# Altium project Projet_Carte_Bras_TurtleBot.PrjPcb
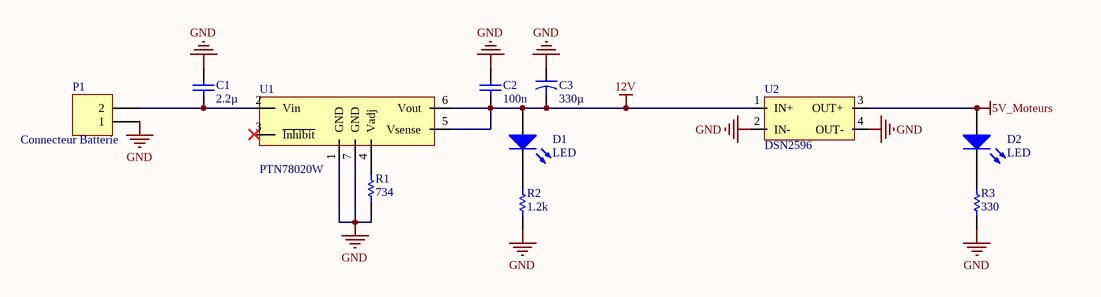
[diagram p0: Alimentations.SchDoc]
4 sheets, 85 parts. Net scope: flat (ports and power ports of the same name join across sheets).
Sheets:
  Alimentations.SchDoc
  Microcontroleur.SchDoc
  Connecteurs.SchDoc
  Controle Moteurs.SchDoc

## Sheet Alimentations.SchDoc
size A4

### Parts
C1  value 2.2µ  [RAD-0.3]  (hidden comment: Cap)
C2  value 100n  [RAD-0.3]  (hidden comment: Cap)
C3  value 330µ  [CAPR5-4X5]  (hidden comment: Cap2)
D1  LED  [C0805]
D2  LED  [C0805]
P1  Connecteur Batterie  [HDR1X2]
R1  value 734  [AXIAL-0.3]  (hidden comment: Res1)
R2  value 1.2k  [AXIAL-0.3]  (hidden comment: Res1)
R3  value 330  [AXIAL-0.3]  (hidden comment: Res1)
U1  PTN78020W
U2  DSN2596

### Nets
5V_Moteurs: D2.1(A) U2.3(OUT+)
12V: C2.1 C3.2 D1.1(A) U1.5(Vsense) U1.6(Vout) U2.1(IN+)
GND: C1.2 C2.2 C3.1 P1.1 R1.1 R2.2 R3.2 U1.1(GND) U1.7(GND) U2.2(IN-) U2.4(OUT-)
NetC1_1: C1.1 P1.2 U1.2(Vin)
NetD1_2: D1.2(K) R2.1
NetD2_2: D2.2(K) R3.1
NetR1_2: R1.2 U1.4(Vadj)

Not connected (* = marked no-connect by the designer): U1 3(~{Inhibit})*

### Library data of the parts
C1 = Cap: 2.2µ; Published: 8-Jun-2000; LatestRevisionDate: 17-Jul-2002; LatestRevisionNote: Re-released for DXP Platform.; PackageReference: RAD-0.3; Publisher: Altium Limited
C2 = Cap: 100n; Published: 8-Jun-2000; LatestRevisionDate: 17-Jul-2002; LatestRevisionNote: Re-released for DXP Platform.; PackageReference: RAD-0.3; Publisher: Altium Limited
C3 = Cap2: 330µ; Published: 23-Sep-2002; PackageReference: CAPR5-4X5; Publisher: Altium Limited
D1 = LED1: LED Bleu; Published: 8-Jun-2000; LatestRevisionDate: 08-Jul-2005; LatestRevisionNote: Mech Layer 1 removed.; PackageReference: LED-1; Publisher: Altium Limited
D2 = LED1: LED Verte; Published: 8-Jun-2000; LatestRevisionDate: 08-Jul-2005; LatestRevisionNote: Mech Layer 1 removed.; PackageReference: LED-1; Publisher: Altium Limited
P1 = Header 2: Header, 2-Pin; LatestRevisionDate: 17-Jul-2002; LatestRevisionNote: Re-released for DXP Platform.; Publisher: Altium Limited
R1 = Res1: 734R 1%; Published: 8-Jun-2000; LatestRevisionDate: 17-Jul-2002; LatestRevisionNote: Re-released for DXP Platform.; PackageReference: AXIAL-0.3; Publisher: Altium Limited
R2 = Res1: 1.2k; Published: 8-Jun-2000; LatestRevisionDate: 17-Jul-2002; LatestRevisionNote: Re-released for DXP Platform.; PackageReference: AXIAL-0.3; Publisher: Altium Limited
R3 = Res1: 330R; Published: 8-Jun-2000; LatestRevisionDate: 17-Jul-2002; LatestRevisionNote: Re-released for DXP Platform.; PackageReference: AXIAL-0.3; Publisher: Altium Limited
U1 = PTN78020W: Alim à découpage 6A
U2 = DSN2596: Module Buck 24V 12V 5V - 3A

## Sheet Microcontroleur.SchDoc
size A4
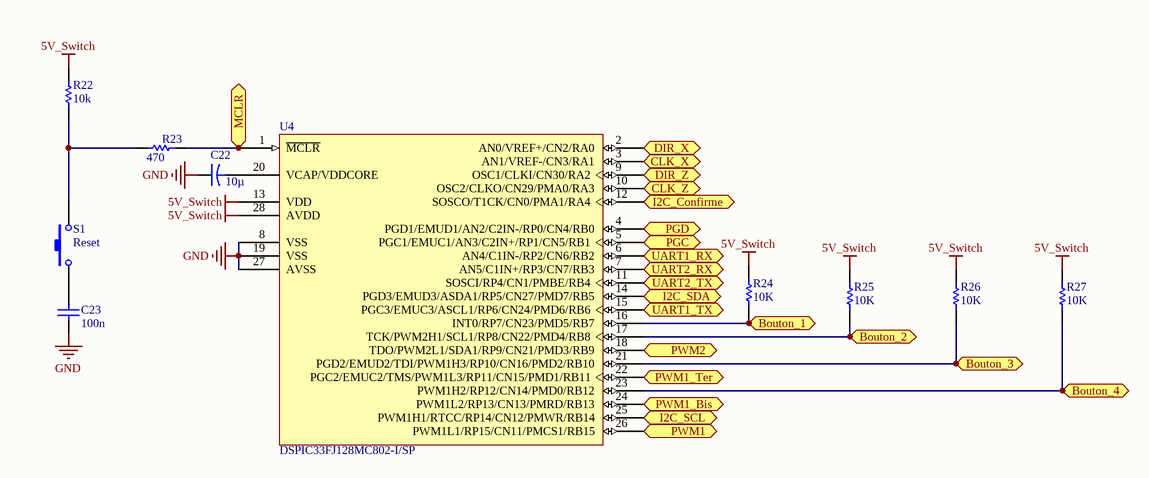
[diagram p1: Microcontroleur.SchDoc]

### Parts
C22  value 10µ  [CAPR5-4X5]  (hidden comment: Cap2)
C23  value 100n  [RAD-0.3]  (hidden comment: Cap)
R22  value 10k  [AXIAL-0.3]  (hidden comment: Res1)
R23  value 470  [AXIAL-0.3]  (hidden comment: Res1)
R24  value 10K  [AXIAL-0.3]  (hidden comment: Res1)
R25  value 10K  [AXIAL-0.3]  (hidden comment: Res1)
R26  value 10K  [AXIAL-0.3]  (hidden comment: Res1)
R27  value 10K  [AXIAL-0.3]  (hidden comment: Res1)
S1  Reset  [SPST-2]
U4  DSPIC33FJ128MC802-I/SP  [SPDIP300-SP28]

### Ports
Bouton_1, Bouton_2, Bouton_3, Bouton_4, CLK_X, CLK_Z, DIR_X, DIR_Z, I2C_Confirme, I2C_SCL, I2C_SDA, MCLR, PGC, PGD, PWM1, PWM1_Bis, PWM1_Ter, PWM2, UART1_RX, UART1_TX, UART2_RX, UART2_TX

### Nets
5V_Switch: R22.2 R24.1 R25.1 R26.1 R27.1 U4.13(VDD) U4.28(AVDD)
GND: C22.1 C23.2 U4.8(VSS) U4.19(VSS) U4.27(AVSS)
NetC22_2: C22.2 U4.20(VCAP/VDDCORE)
NetC23_1: C23.1 S1.1
NetJ1_18: U4.9(OSC1/CLKI/CN30/RA2) ; port DIR_Z
NetJ1_19: U4.10(OSC2/CLKO/CN29/PMA0/RA3) ; port CLK_Z
NetJ2_18: U4.2(AN0/VREF+/CN2/RA0) ; port DIR_X
NetJ2_19: U4.3(AN1/VREF-/CN3/RA1) ; port CLK_X
NetP2_1: U4.18(TDO/PWM2L1/SDA1/RP9/CN21/PMD3/RB9) ; port PWM2
NetP3_2: R24.2 U4.16(INT0/RP7/CN23/PMD5/RB7) ; port Bouton_1
NetP5_2: U4.7(AN5/C1IN+/RP3/CN7/RB3) ; port UART2_RX
NetP5_3: U4.11(SOSCI/RP4/CN1/PMBE/RB4) ; port UART2_TX
NetP6_2: R25.2 U4.17(TCK/PWM2H1/SCL1/RP8/CN22/PMD4/RB8) ; port Bouton_2
NetP8_1: U4.22(PGC2/EMUC2/TMS/PWM1L3/RP11/CN15/PMD1/RB11) ; port PWM1_Ter
NetP9_2: R26.2 U4.21(PGD2/EMUD2/TDI/PWM1H3/RP10/CN16/PMD2/RB10) ; port Bouton_3
NetP11_2: R27.2 U4.23(PWM1H2/RP12/CN14/PMD0/RB12) ; port Bouton_4
NetP13_1: U4.24(PWM1L2/RP13/CN13/PMRD/RB13) ; port PWM1_Bis
NetP14_1: R23.2 U4.1(~{MCLR}) ; port MCLR
NetP14_4: U4.4(PGD1/EMUD1/AN2/C2IN-/RP0/CN4/RB0) ; port PGD
NetP14_5: U4.5(PGC1/EMUC1/AN3/C2IN+/RP1/CN5/RB1) ; port PGC
NetP16_1: U4.26(PWM1L1/RP15/CN11/PMCS1/RB15) ; port PWM1
NetQ1_1: U4.15(PGC3/EMUC3/ASCL1/RP6/CN24/PMD6/RB6) ; port UART1_TX
NetQ2_1: U4.6(AN4/C1IN-/RP2/CN6/RB2) ; port UART1_RX
NetR22_1: R22.1 R23.1 S1.2
NetU3_11: U4.25(PWM1H1/RTCC/RP14/CN12/PMWR/RB14) ; port I2C_SCL
NetU3_12: U4.12(SOSCO/T1CK/CN0/PMA1/RA4) ; port I2C_Confirme
NetU3_14: U4.14(PGD3/EMUD3/ASDA1/RP5/CN27/PMD7/RB5) ; port I2C_SDA

### Library data of the parts
C22 = Cap2: 10µ; Published: 23-Sep-2002; PackageReference: CAPR5-4X5; Publisher: Altium Limited
C23 = Cap: 100n; Published: 8-Jun-2000; LatestRevisionDate: 17-Jul-2002; LatestRevisionNote: Re-released for DXP Platform.; PackageReference: RAD-0.3; Publisher: Altium Limited
R22 R24-R27 = Res1: 10k; Published: 8-Jun-2000; LatestRevisionDate: 17-Jul-2002; LatestRevisionNote: Re-released for DXP Platform.; PackageReference: AXIAL-0.3; Publisher: Altium Limited
R23 = Res1: 470R; Published: 8-Jun-2000; LatestRevisionDate: 17-Jul-2002; LatestRevisionNote: Re-released for DXP Platform.; PackageReference: AXIAL-0.3; Publisher: Altium Limited
S1 = SW-PB: Bouton Reset; Published: 24-Mar-1999; LatestRevisionDate: 17-Jul-2002; LatestRevisionNote: Re-released for DXP Platform.; PackageReference: SPST-2; Publisher: Altium Limited; PackageDescription: Switch; 2 Leads
U4 = DSPIC33FJ128MC802-I/SP: High-Performance 16-bit Digital Signal Controller, 128 KB Flash, 16 KB RAM, 28-Pin SPDIP, Industrial Temperature; FirstPublished: 29-Jan-2009; LatestRevisionDate: 02-Dec-2009; LatestRevisionNote: Updated to datasheet revision D, Nov-2009; DatasheetVersion: revD, Nov-2009; PackageVersion: revBB, Aug-2009; PackageReference: SPDIP300-SP28; Publisher: Altium Limited; PackageDescription: 28-Lead Skinny Plastic Dual In-Line (SP) - 300 mil Body [SPDIP]; Supplier 1: Digi-Key; Supplier Part Number 1: DSPIC33FJ128MC802-I/SP-ND; Supplier 2: Farnell; Supplier Part Number 2: 1576808; Supplier 3: Newark; Supplier Part Number 3: 39M8141; ComponentLink1Description: Datasheet; ComponentLink1URL: http://ww1.microchip.com/downloads/en/DeviceDoc/70291D.pdf; ComponentLink2Description: Packaging Specification; ComponentLink2URL: http://www.microchip.com/stellent/groups/techpub_sg/documents/packagingspec/en012702.pdf; ComponentLink3Description: Microchip.com Home; ComponentLink3URL: http://www.microchip.com/

## Sheet Connecteurs.SchDoc
size A4
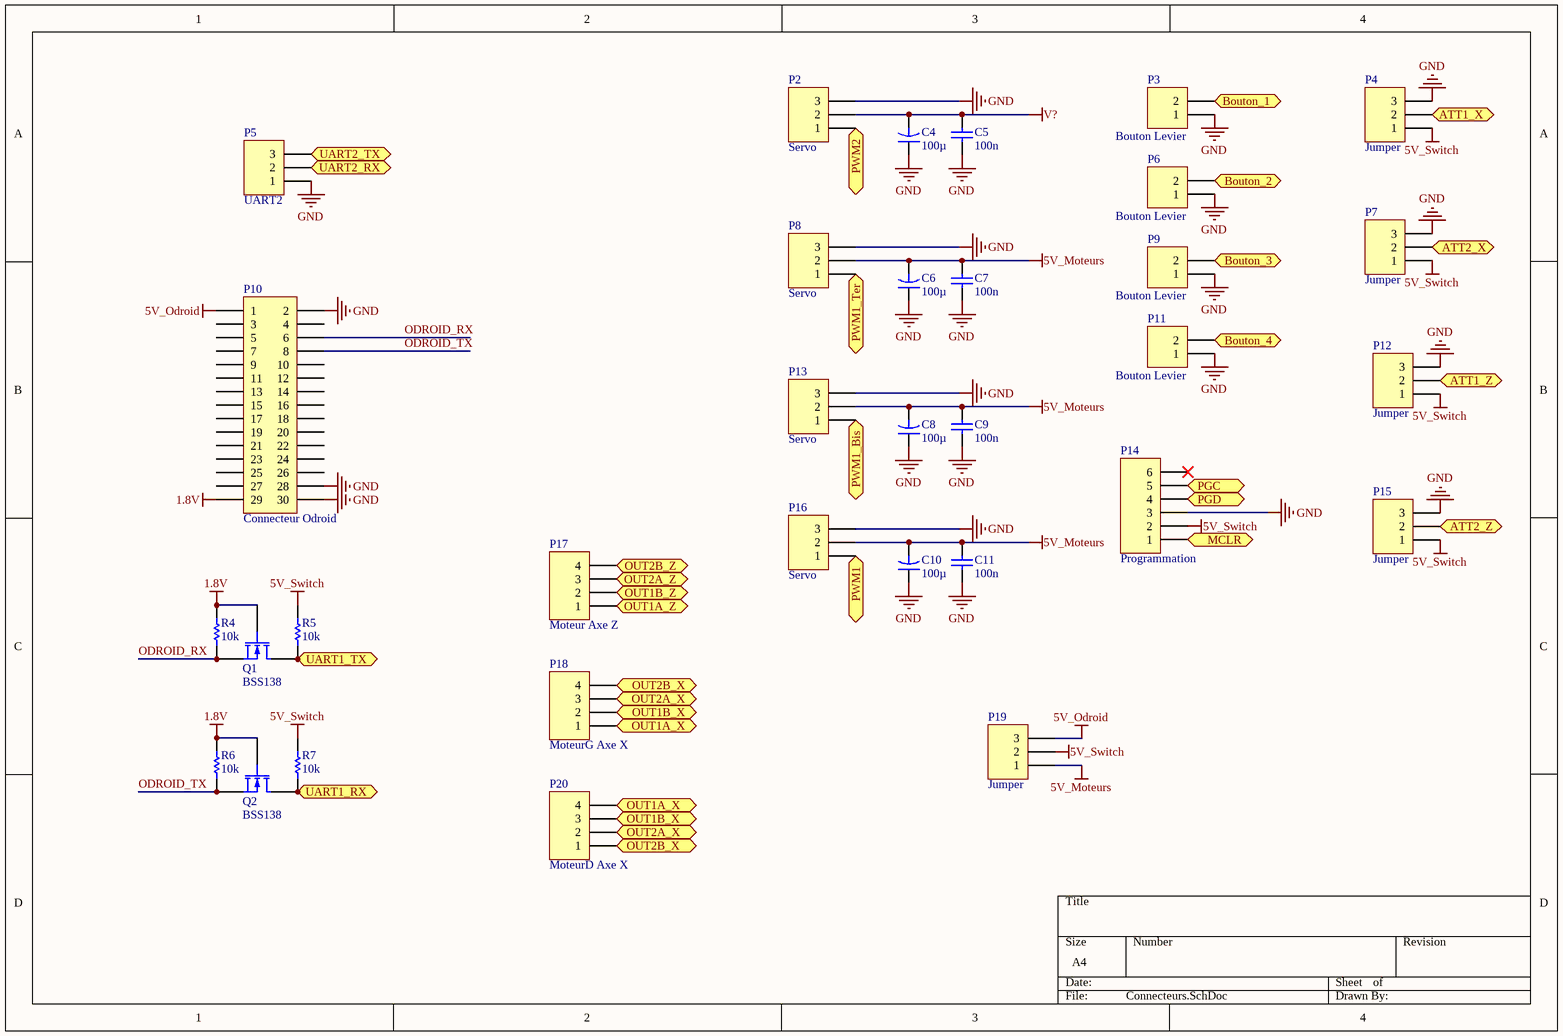
[diagram p2: Connecteurs.SchDoc]

### Parts
C4  value 100µ  [CAPR5-4X5]  (hidden comment: Cap2)
C5  value 100n  [RAD-0.3]  (hidden comment: Cap)
C6  value 100µ  [CAPR5-4X5]  (hidden comment: Cap2)
C7  value 100n  [RAD-0.3]  (hidden comment: Cap)
C8  value 100µ  [CAPR5-4X5]  (hidden comment: Cap2)
C9  value 100n  [RAD-0.3]  (hidden comment: Cap)
C10  value 100µ  [CAPR5-4X5]  (hidden comment: Cap2)
C11  value 100n  [RAD-0.3]  (hidden comment: Cap)
P2  Servo  [HDR1X3]
P3  Bouton Levier  [HDR1X2]
P4  Jumper  [HDR1X3]
P5  UART2  [HDR1X3]
P6  Bouton Levier  [HDR1X2]
P7  Jumper  [HDR1X3]
P8  Servo  [HDR1X3]
P9  Bouton Levier  [HDR1X2]
P10  Connecteur Odroid  [HDR2X15]
P11  Bouton Levier  [HDR1X2]
P12  Jumper  [HDR1X3]
P13  Servo  [HDR1X3]
P14  Programmation  [HDR1X6]
P15  Jumper  [HDR1X3]
P16  Servo  [HDR1X3]
P17  Moteur Axe Z  [HDR1X4]
P18  MoteurG Axe X  [HDR1X4]
P19  Jumper  [HDR1X3]
P20  MoteurD Axe X  [HDR1X4]
Q1  BSS138  [E3]
Q2  BSS138  [E3]
R4  value 10k  [AXIAL-0.3]  (hidden comment: Res1)
R5  value 10k  [AXIAL-0.3]  (hidden comment: Res1)
R6  value 10k  [AXIAL-0.3]  (hidden comment: Res1)
R7  value 10k  [AXIAL-0.3]  (hidden comment: Res1)

### Ports
ATT1_X, ATT1_Z, ATT2_X, ATT2_Z, Bouton_1, Bouton_2, Bouton_3, Bouton_4, MCLR, OUT1A_X, OUT1A_Z, OUT1B_X, OUT1B_Z, OUT2A_X, OUT2A_Z, OUT2B_X, OUT2B_Z, PGC, PGD, PWM1, PWM1_Bis, PWM1_Ter, PWM2, UART1_RX, UART1_TX, UART2_RX, UART2_TX

### Nets
1.8V: P10.29 Q1.2(G) Q2.2(G) R4.1 R6.1
5V_Moteurs: C6.2 C7.1 C8.2 C9.1 C10.2 C11.1 P8.2 P13.2 P16.2 P19.1
5V_Odroid: P10.1 P19.3
5V_Switch: P4.1 P7.1 P12.1 P14.2 P15.1 P19.2 R5.1 R7.1
GND: C4.1 C5.2 C6.1 C7.2 C8.1 C9.2 C10.1 C11.2 P2.3 P3.1 P4.3 P5.1 P6.1 P7.3 P8.3 P9.1 P10.2 P10.28 P10.30 P11.1 P12.3 P13.3 P14.3 P15.3 P16.3
V?: C4.2 C5.1 P2.2
ODROID_RX: P10.6 Q1.3(S) R4.2
ODROID_TX: P10.8 Q2.3(S) R6.2
NetJ1_3: P17.1 ; port OUT1A_Z
NetJ1_7: P17.2 ; port OUT1B_Z
NetJ1_8: P17.3 ; port OUT2A_Z
NetJ1_12: P17.4 ; port OUT2B_Z
NetJ1_24: P12.2 ; port ATT1_Z
NetJ1_25: P15.2 ; port ATT2_Z
NetJ2_3: P18.1 P20.4 ; port OUT1A_X
NetJ2_7: P18.2 P20.3 ; port OUT1B_X
NetJ2_8: P18.3 P20.2 ; port OUT2A_X
NetJ2_12: P18.4 P20.1 ; port OUT2B_X
NetJ2_24: P4.2 ; port ATT1_X
NetJ2_25: P7.2 ; port ATT2_X
NetP2_1: P2.1 ; port PWM2
NetP3_2: P3.2 ; port Bouton_1
NetP5_2: P5.2 ; port UART2_RX
NetP5_3: P5.3 ; port UART2_TX
NetP6_2: P6.2 ; port Bouton_2
NetP8_1: P8.1 ; port PWM1_Ter
NetP9_2: P9.2 ; port Bouton_3
NetP11_2: P11.2 ; port Bouton_4
NetP13_1: P13.1 ; port PWM1_Bis
NetP14_1: P14.1 ; port MCLR
NetP14_4: P14.4 ; port PGD
NetP14_5: P14.5 ; port PGC
NetP16_1: P16.1 ; port PWM1
NetQ1_1: Q1.1(D) R5.2 ; port UART1_TX
NetQ2_1: Q2.1(D) R7.2 ; port UART1_RX

Not connected (* = marked no-connect by the designer): P10 3 4 5 7 9 10 11 12 13 14 15 16 17 18 19 20 21 22 23 24 25 26 27; P14 6*

### Library data of the parts
C4 C6 C8 C10 = Cap2: 100µ; Published: 23-Sep-2002; PackageReference: CAPR5-4X5; Publisher: Altium Limited
C5 C7 C9 C11 = Cap: 100n; Published: 8-Jun-2000; LatestRevisionDate: 17-Jul-2002; LatestRevisionNote: Re-released for DXP Platform.; PackageReference: RAD-0.3; Publisher: Altium Limited
P2 P4 P5 P7 P8 P12 P13 P15 P16 P19 = Header 3: Header, 3-Pin; LatestRevisionDate: 17-Jul-2002; LatestRevisionNote: Re-released for DXP Platform.; Publisher: Altium Limited
P3 P6 P9 P11 = Header 2: Header, 2-Pin; LatestRevisionDate: 17-Jul-2002; LatestRevisionNote: Re-released for DXP Platform.; Publisher: Altium Limited
P10 = Header 15X2: Header, 15-Pin, Dual row; LatestRevisionDate: 17-Jul-2002; LatestRevisionNote: Re-released for DXP Platform.; Publisher: Altium Limited
P14 = Header 6: Header, 6-Pin; LatestRevisionDate: 17-Jul-2002; LatestRevisionNote: Re-released for DXP Platform.; Publisher: Altium Limited
P17 P18 P20 = Header 4: Header, 4-Pin; LatestRevisionDate: 17-Jul-2002; LatestRevisionNote: Re-released for DXP Platform.; Publisher: Altium Limited
Q1 Q2 = MOSFET-N: N-Channel MOSFET; Published: 8-Jun-2000; LatestRevisionDate: 17-Jul-2002; LatestRevisionNote: Re-released for DXP Platform.; PackageVersion: 1995/1996; PackageReference: E3; Publisher: Altium Limited; PackageDescription: TO, Flat Index; 3 In-Line, Axial Leads; Body Dia. 4.6mm; Lead Dia. 0.5 mm (max)
R4-R7 = Res1: 10k; Published: 8-Jun-2000; LatestRevisionDate: 17-Jul-2002; LatestRevisionNote: Re-released for DXP Platform.; PackageReference: AXIAL-0.3; Publisher: Altium Limited

## Sheet Controle Moteurs.SchDoc
size A4
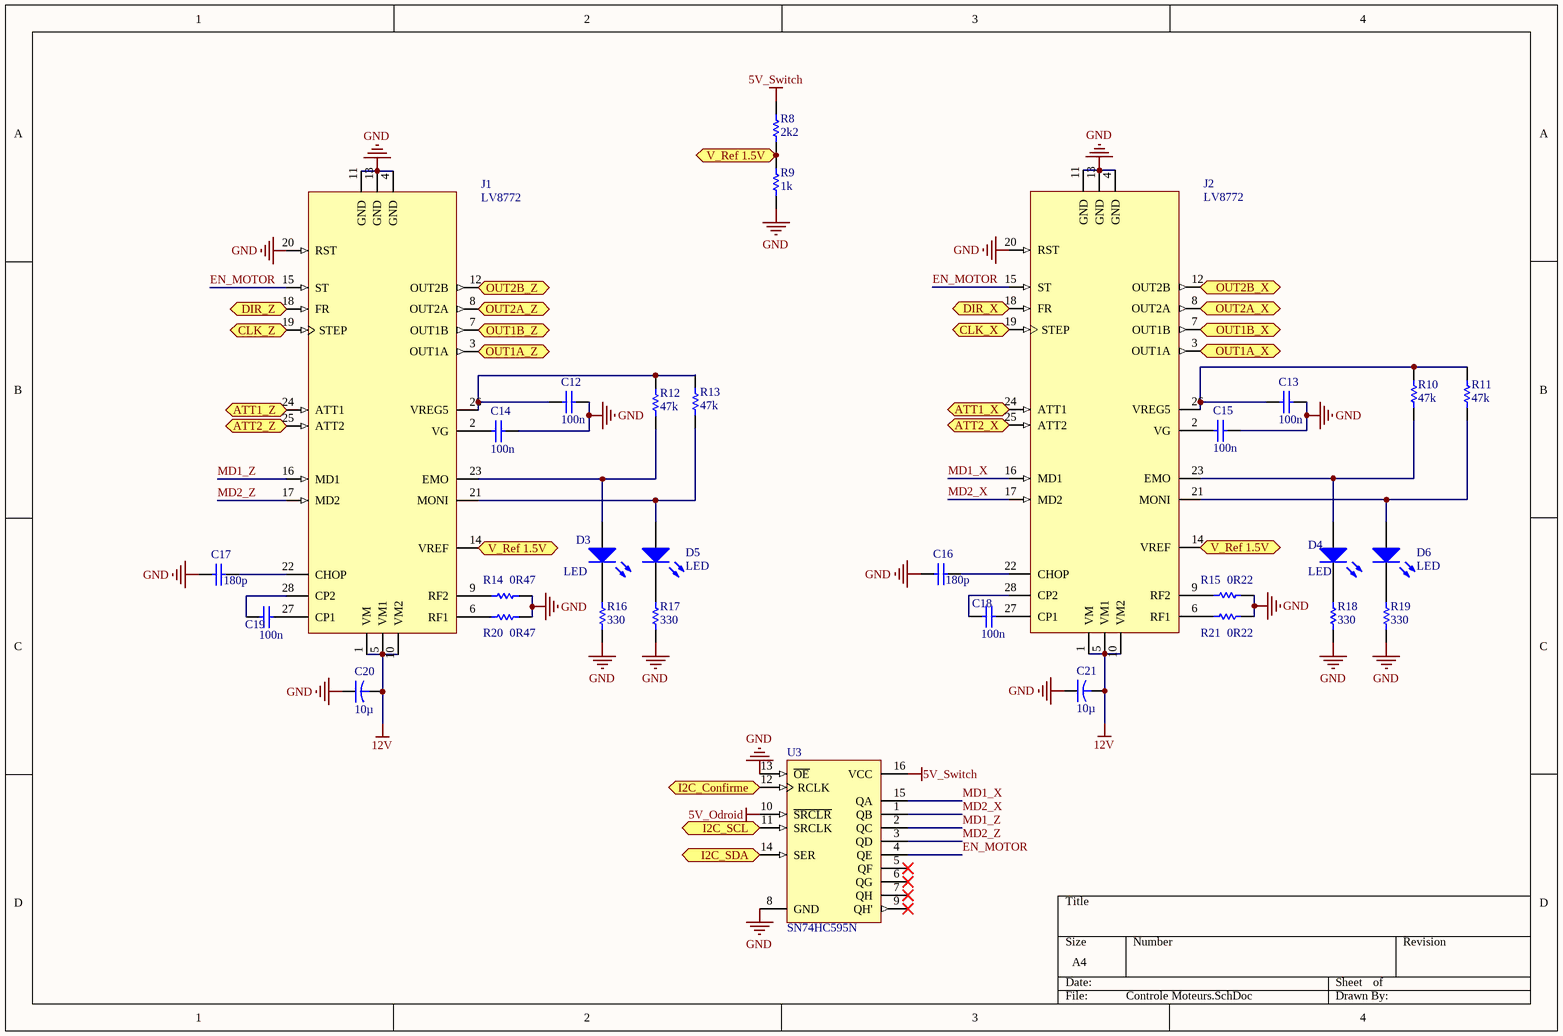
[diagram p3: Controle Moteurs.SchDoc]

### Parts
C12  value 100n  [RAD-0.3]  (hidden comment: Cap)
C13  value 100n  [RAD-0.3]  (hidden comment: Cap)
C14  value 100n  [RAD-0.3]  (hidden comment: Cap)
C15  value 100n  [RAD-0.3]  (hidden comment: Cap)
C16  value 180p  [RAD-0.3]  (hidden comment: Cap)
C17  value 180p  [RAD-0.3]  (hidden comment: Cap)
C18  value 100n  [RAD-0.3]  (hidden comment: Cap)
C19  value 100n  [RAD-0.3]  (hidden comment: Cap)
C20  value 10µ  [CAPR5-4X5]  (hidden comment: Cap2)
C21  value 10µ  [CAPR5-4X5]  (hidden comment: Cap2)
D3  LED  [C0805]
D4  LED  [C0805]
D5  LED  [C0805]
D6  LED  [C0805]
J1  LV8772
J2  LV8772
R8  value 2k2  [AXIAL-0.3]  (hidden comment: Res1)
R9  value 1k  [AXIAL-0.3]  (hidden comment: Res1)
R10  value 47k  [AXIAL-0.3]  (hidden comment: Res1)
R11  value 47k  [AXIAL-0.3]  (hidden comment: Res1)
R12  value 47k  [AXIAL-0.3]  (hidden comment: Res1)
R13  value 47k  [AXIAL-0.3]  (hidden comment: Res1)
R14  value 0R47  [AXIAL-0.3]  (hidden comment: Res1)
R15  value 0R22  [AXIAL-0.3]  (hidden comment: Res1)
R16  value 330  [AXIAL-0.3]  (hidden comment: Res1)
R17  value 330  [AXIAL-0.3]  (hidden comment: Res1)
R18  value 330  [AXIAL-0.3]  (hidden comment: Res1)
R19  value 330  [AXIAL-0.3]  (hidden comment: Res1)
R20  value 0R47  [AXIAL-0.3]  (hidden comment: Res1)
R21  value 0R22  [AXIAL-0.3]  (hidden comment: Res1)
U3  SN74HC595N  [N016]

### Ports
ATT1_X, ATT1_Z, ATT2_X, ATT2_Z, CLK_X, CLK_Z, DIR_X, DIR_Z, I2C_Confirme, I2C_SCL, I2C_SDA, OUT1A_X, OUT1A_Z, OUT1B_X, OUT1B_Z, OUT2A_X, OUT2A_Z, OUT2B_X, OUT2B_Z, V_Ref 1.5V

### Nets
5V_Odroid: U3.10(~{SRCLR})
5V_Switch: R8.1 U3.16(VCC)
12V: C20.2 C21.2 J1.1(VM) J1.5(VM1) J1.10(VM2) J2.1(VM) J2.5(VM1) J2.10(VM2)
GND: C12.2 C13.2 C14.1 C15.1 C16.2 C17.2 C20.1 C21.1 J1.4(GND) J1.11(GND) J1.13(GND) J1.20(RST) J2.4(GND) J2.11(GND) J2.13(GND) J2.20(RST) R9.2 R14.1 R15.1 R16.2 R17.2 R18.2 R19.2 R20.1 R21.1 U3.8(GND) U3.13(~{OE})
EN_MOTOR: J1.15(ST) J2.15(ST) U3.4(QE)
MD1_X: J2.16(MD1) U3.15(QA)
MD1_Z: J1.16(MD1) U3.2(QC)
MD2_X: J2.17(MD2) U3.1(QB)
MD2_Z: J1.17(MD2) U3.3(QD)
NetC12_1: C12.1 J1.26(VREG5) R12.1 R13.1
NetC13_1: C13.1 J2.26(VREG5) R10.1 R11.1
NetC14_2: C14.2 J1.2(VG)
NetC15_2: C15.2 J2.2(VG)
NetC16_1: C16.1 J2.22(CHOP)
NetC17_1: C17.1 J1.22(CHOP)
NetC18_1: C18.1 J2.27(CP1)
NetC18_2: C18.2 J2.28(CP2)
NetC19_1: C19.1 J1.27(CP1)
NetC19_2: C19.2 J1.28(CP2)
NetD3_1: D3.1(A) J1.23(EMO) R12.2
NetD3_2: D3.2(K) R16.1
NetD4_1: D4.1(A) J2.23(EMO) R10.2
NetD4_2: D4.2(K) R18.1
NetD5_1: D5.1(A) J1.21(MONI) R13.2
NetD5_2: D5.2(K) R17.1
NetD6_1: D6.1(A) J2.21(MONI) R11.2
NetD6_2: D6.2(K) R19.1
NetJ1_3: J1.3(OUT1A) ; port OUT1A_Z
NetJ1_6: J1.6(RF1) R20.2
NetJ1_7: J1.7(OUT1B) ; port OUT1B_Z
NetJ1_8: J1.8(OUT2A) ; port OUT2A_Z
NetJ1_9: J1.9(RF2) R14.2
NetJ1_12: J1.12(OUT2B) ; port OUT2B_Z
NetJ1_14: J1.14(VREF) J2.14(VREF) R8.2 R9.1 ; port V_Ref 1.5V
NetJ1_18: J1.18(FR) ; port DIR_Z
NetJ1_19: J1.19(STEP) ; port CLK_Z
NetJ1_24: J1.24(ATT1) ; port ATT1_Z
NetJ1_25: J1.25(ATT2) ; port ATT2_Z
NetJ2_3: J2.3(OUT1A) ; port OUT1A_X
NetJ2_6: J2.6(RF1) R21.2
NetJ2_7: J2.7(OUT1B) ; port OUT1B_X
NetJ2_8: J2.8(OUT2A) ; port OUT2A_X
NetJ2_9: J2.9(RF2) R15.2
NetJ2_12: J2.12(OUT2B) ; port OUT2B_X
NetJ2_18: J2.18(FR) ; port DIR_X
NetJ2_19: J2.19(STEP) ; port CLK_X
NetJ2_24: J2.24(ATT1) ; port ATT1_X
NetJ2_25: J2.25(ATT2) ; port ATT2_X
NetU3_11: U3.11(SRCLK) ; port I2C_SCL
NetU3_12: U3.12(RCLK) ; port I2C_Confirme
NetU3_14: U3.14(SER) ; port I2C_SDA

Not connected (* = marked no-connect by the designer): U3 5(QF)* 6(QG)* 7(QH)* 9(QH')*

### Library data of the parts
C12-C15 C18 C19 = Cap: 100n; Published: 8-Jun-2000; LatestRevisionDate: 17-Jul-2002; LatestRevisionNote: Re-released for DXP Platform.; PackageReference: RAD-0.3; Publisher: Altium Limited
C16 C17 = Cap: 180p; Published: 8-Jun-2000; LatestRevisionDate: 17-Jul-2002; LatestRevisionNote: Re-released for DXP Platform.; PackageReference: RAD-0.3; Publisher: Altium Limited
C20 C21 = Cap2: 10µ; Published: 23-Sep-2002; PackageReference: CAPR5-4X5; Publisher: Altium Limited
D3-D6 = LED1: LED Rouge; Published: 8-Jun-2000; LatestRevisionDate: 08-Jul-2005; LatestRevisionNote: Mech Layer 1 removed.; PackageReference: LED-1; Publisher: Altium Limited
J1 J2 = LV8772: Driver Pas à Pas
R8 = Res1: 2.2k; Published: 8-Jun-2000; LatestRevisionDate: 17-Jul-2002; LatestRevisionNote: Re-released for DXP Platform.; PackageReference: AXIAL-0.3; Publisher: Altium Limited
R9 = Res1: 1k; Published: 8-Jun-2000; LatestRevisionDate: 17-Jul-2002; LatestRevisionNote: Re-released for DXP Platform.; PackageReference: AXIAL-0.3; Publisher: Altium Limited
R10-R13 = Res1: 47k; Published: 8-Jun-2000; LatestRevisionDate: 17-Jul-2002; LatestRevisionNote: Re-released for DXP Platform.; PackageReference: AXIAL-0.3; Publisher: Altium Limited
R14 R20 = Res1: 470m; Published: 8-Jun-2000; LatestRevisionDate: 17-Jul-2002; LatestRevisionNote: Re-released for DXP Platform.; PackageReference: AXIAL-0.3; Publisher: Altium Limited
R15 R21 = Res1: 220m; Published: 8-Jun-2000; LatestRevisionDate: 17-Jul-2002; LatestRevisionNote: Re-released for DXP Platform.; PackageReference: AXIAL-0.3; Publisher: Altium Limited
R16-R19 = Res1: 330R; Published: 8-Jun-2000; LatestRevisionDate: 17-Jul-2002; LatestRevisionNote: Re-released for DXP Platform.; PackageReference: AXIAL-0.3; Publisher: Altium Limited
U3 = SN74HC595N: 8-Bit Shift Register with 3-State Output Registers; Published: 8-Jun-2000; LatestRevisionDate: 04-Mar-2005; LatestRevisionNote: Stylized 3D Model Added.; DatasheetVersion: May-1997; PackageVersion: Oct-1995; PackageReference: N016; Publisher: Altium Limited; PackageDescription: DIP; 16 Leads; Row Spacing 7.62 mm; Pitch 2.54 mm; Code_JEDEC: MS-001-BB; ComponentLink1Description: Manufacturer Link; ComponentLink1URL: http://www.ti.com/; ComponentLink2Description: Datasheet; ComponentLink2URL: http://www-s.ti.com/sc/ds/sn74hc595.pdf

## Nets that join several sheets
5V_Moteurs: Alimentations (D2.1 U2.3), Connecteurs (10 pins)
5V_Odroid: Connecteurs (P10.1 P19.3), Controle Moteurs (U3.10)
5V_Switch: Microcontroleur (7 pins), Connecteurs (8 pins), Controle Moteurs (R8.1 U3.16)
12V: Alimentations (6 pins), Controle Moteurs (8 pins)
GND: Alimentations (11 pins), Microcontroleur (5 pins), Connecteurs (25 pins), Controle Moteurs (27 pins)
NetJ1_3: Connecteurs (P17.1), Controle Moteurs (J1.3)
NetJ1_7: Connecteurs (P17.2), Controle Moteurs (J1.7)
NetJ1_8: Connecteurs (P17.3), Controle Moteurs (J1.8)
NetJ1_12: Connecteurs (P17.4), Controle Moteurs (J1.12)
NetJ1_18: Microcontroleur (U4.9), Controle Moteurs (J1.18)
NetJ1_19: Microcontroleur (U4.10), Controle Moteurs (J1.19)
NetJ1_24: Connecteurs (P12.2), Controle Moteurs (J1.24)
NetJ1_25: Connecteurs (P15.2), Controle Moteurs (J1.25)
NetJ2_3: Connecteurs (P18.1 P20.4), Controle Moteurs (J2.3)
NetJ2_7: Connecteurs (P18.2 P20.3), Controle Moteurs (J2.7)
NetJ2_8: Connecteurs (P18.3 P20.2), Controle Moteurs (J2.8)
NetJ2_12: Connecteurs (P18.4 P20.1), Controle Moteurs (J2.12)
NetJ2_18: Microcontroleur (U4.2), Controle Moteurs (J2.18)
NetJ2_19: Microcontroleur (U4.3), Controle Moteurs (J2.19)
NetJ2_24: Connecteurs (P4.2), Controle Moteurs (J2.24)
NetJ2_25: Connecteurs (P7.2), Controle Moteurs (J2.25)
NetP2_1: Microcontroleur (U4.18), Connecteurs (P2.1)
NetP3_2: Microcontroleur (R24.2 U4.16), Connecteurs (P3.2)
NetP5_2: Microcontroleur (U4.7), Connecteurs (P5.2)
NetP5_3: Microcontroleur (U4.11), Connecteurs (P5.3)
NetP6_2: Microcontroleur (R25.2 U4.17), Connecteurs (P6.2)
NetP8_1: Microcontroleur (U4.22), Connecteurs (P8.1)
NetP9_2: Microcontroleur (R26.2 U4.21), Connecteurs (P9.2)
NetP11_2: Microcontroleur (R27.2 U4.23), Connecteurs (P11.2)
NetP13_1: Microcontroleur (U4.24), Connecteurs (P13.1)
NetP14_1: Microcontroleur (R23.2 U4.1), Connecteurs (P14.1)
NetP14_4: Microcontroleur (U4.4), Connecteurs (P14.4)
NetP14_5: Microcontroleur (U4.5), Connecteurs (P14.5)
NetP16_1: Microcontroleur (U4.26), Connecteurs (P16.1)
NetQ1_1: Microcontroleur (U4.15), Connecteurs (Q1.1 R5.2)
NetQ2_1: Microcontroleur (U4.6), Connecteurs (Q2.1 R7.2)
NetU3_11: Microcontroleur (U4.25), Controle Moteurs (U3.11)
NetU3_12: Microcontroleur (U4.12), Controle Moteurs (U3.12)
NetU3_14: Microcontroleur (U4.14), Controle Moteurs (U3.14)